# Altium schematic sheet Buck_Schematic.schdoc
size 356 x 151 mm; SheetNumber: 1; SheetTotal: 1
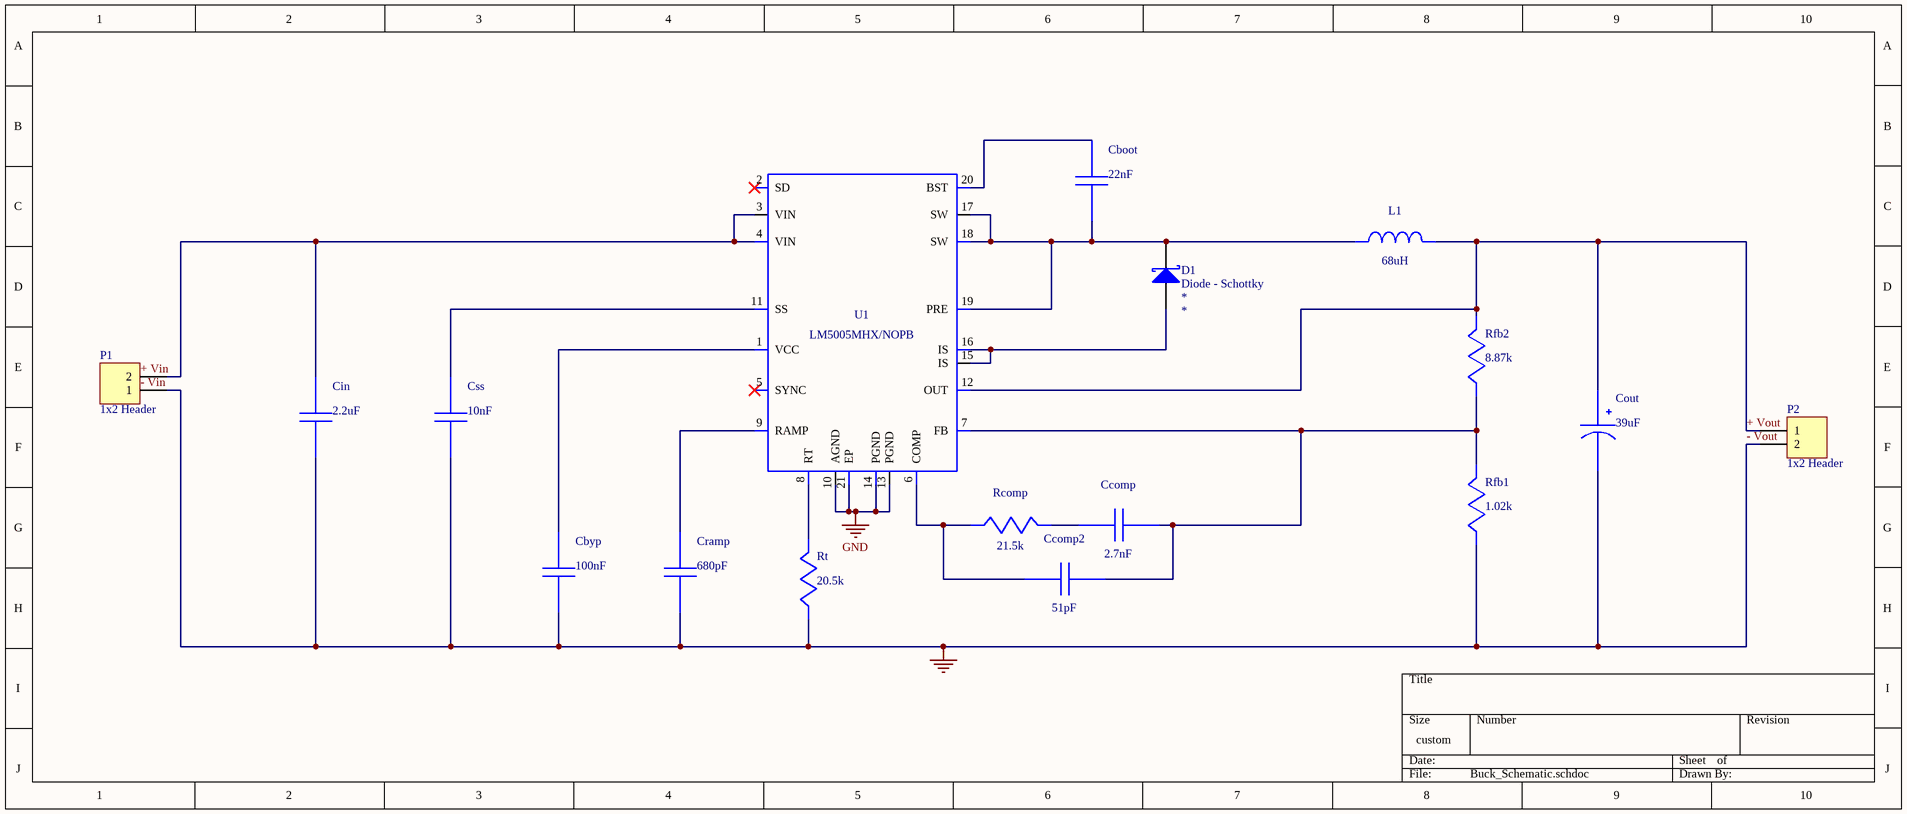
[diagram p0: Buck_Schematic.schdoc]

## Parts
Cboot  value 22nF  [0805 - Capacitor]  (hidden comment: C0805C223K5RACTU)
Cbyp  value 100nF  [0805 - Capacitor]  (hidden comment: C0805C104M5RACTU)
Ccomp  value 2.7nF  (hidden comment: GRM033R71C272KA88D)
Ccomp2  value 51pF  [0805 - Capacitor]  (hidden comment: CL21C510JBANNNC)
Cin  value 2.2uF  [1210 - Capacitor]  (hidden comment: C3225X7R2A225K230AB)
Cout  value 39uF  (hidden comment: 16SVPC39MV)
Cramp  value 680pF  [0603 - Capacitor]  (hidden comment: C0603C681K5RACTU)
Css  value 10nF  [0805 - Capacitor]  (hidden comment: CC0805KRX7R9BB103)
D1  Diode - Schottky
L1  value 68uH  [MSS1210 - INDUCTOR]  (hidden comment: MSS1210-683MEB)
P1  1x2 Header  [HDR1X2]
P2  1x2 Header  [HDR1X2]
Rcomp  value 21.5k  [0603 - Resistor]  (hidden comment: CRCW060321K5FKEA)
Rfb1  value 1.02k  [0805 - Resistor]  (hidden comment: ERJ-6ENF1021V)
Rfb2  value 8.87k  [0805 - Resistor]  (hidden comment: ERJ-6ENF8871V)
Rt  value 20.5k  [0603 - Resistor]  (hidden comment: CRCW060320K5FKEA)
U1  LM5005MHX/NOPB  [LM5005]

## Nets
- Vout: Cbyp.2 Cin.2 Cout.2(-) Cramp.2 Css.2 P1.1 P2.2 Rfb1.2 Rt.2  [also labelled 0]
GND: U1.10(AGND) U1.13(PGND) U1.14(PGND) U1.21(EP)
+ Vout: Cout.1(+) L1.2 P2.1 Rfb2.1 U1.12(OUT)
NetCboot_1: Cboot.1 U1.20(BST)
NetCboot_2: Cboot.2 D1.1(K) L1.1 U1.17(SW) U1.18(SW) U1.19(PRE)
NetCbyp_1: Cbyp.1 U1.1(VCC)
NetCcomp2_2: Ccomp2.2 Rcomp.2 U1.6(COMP)
NetCcomp_1: Ccomp.1 Ccomp2.1 Rfb1.1 Rfb2.2 U1.7(FB)
NetCcomp_2: Ccomp.2 Rcomp.1
NetCin_1: Cin.1 P1.2 U1.3(VIN) U1.4(VIN)
NetCramp_1: Cramp.1 U1.9(RAMP)
NetCss_1: Css.1 U1.11(SS)
NetD1_3: D1.3(A) U1.15(IS) U1.16(IS)
NetRt_1: Rt.1 U1.8(RT)

Not connected (* = marked no-connect by the designer): U1 2(SD)* 5(SYNC)*

## Notes on the sheet
- Labels drawn without touching a wire or pin: + Vin, - Vin

## Library data of the parts
Cboot = C0805C223K5RACTU: Manufacturer Name: Kemet; PackageReference: C0805C223K5RACTU; Manufacturer Part Number: C0805C223K5RACTU
Cbyp = C0805C104M5RACTU: Manufacturer Name: Kemet; PackageReference: C0805C104M5RACTU; Manufacturer Part Number: C0805C104M5RACTU
Ccomp = GRM033R71C272KA88D: GRM033R71C272KA8; Manufacturer Name: MuRata; PackageReference: GRM033R71C272KA88D; Manufacturer Part Number: GRM033R71C272KA88D
Ccomp2 = CL21C510JBANNNC: Manufacturer Name: Samsung Electro-Mechanics; PackageReference: CL21C510JBANNNC; Manufacturer Part Number: CL21C510JBANNNC
Cin = C3225X7R2A225K230AB: C3225X7R2A225K23; Manufacturer Name: TDK; PackageReference: C3225X7R2A225K230AB; Manufacturer Part Number: C3225X7R2A225K230AB
Cout = 16SVPC39MV: Manufacturer Name: Panasonic; PackageReference: 16SVPC39MV; Manufacturer Part Number: 16SVPC39MV
Cramp = C0603C681K5RACTU: Manufacturer Name: Kemet; PackageReference: C0603C681K5RACTU; Manufacturer Part Number: C0603C681K5RACTU
Css = CC0805KRX7R9BB103: CC0805KRX7R9BB10; Manufacturer Name: Yageo; PackageReference: CC0805KRX7R9BB103; Manufacturer Part Number: CC0805KRX7R9BB103
D1 = Diode - Schottky: Schottky Rectifier; Rating: *; Supplier Part Number: *; Supplier: *; Manufacturer: *; ComponentLink1Description: Manufacturer Link; ComponentLink1URL: http://www.irf.com/; ComponentLink2Description: Datasheet; ComponentLink2URL: http://www.irf.com/product-info/datasheets/data/10tq.pdf; Value: *; Manufacturer Part Number: *
L1 = MSS1210-683MEB: Unknown; Manufacturer Name: Coilcraft; PackageReference: MSS1210-683MEB; Manufacturer Part Number: MSS1210-683MEB
P1 P2 = 1x2 Header: 1x2 Pin Header
Rcomp = CRCW060321K5FKEA: Manufacturer Name: Vishay-Dale; PackageReference: CRCW060321K5FKEA; Manufacturer Part Number: CRCW060321K5FKEA
Rfb1 = ERJ-6ENF1021V: Manufacturer Name: Panasonic; PackageReference: ERJ-6ENF1021V; Manufacturer Part Number: ERJ-6ENF1021V
Rfb2 = ERJ-6ENF8871V: Manufacturer Name: Panasonic; PackageReference: ERJ-6ENF8871V; Manufacturer Part Number: ERJ-6ENF8871V
Rt = CRCW060320K5FKEA: Manufacturer Name: Vishay-Dale; PackageReference: CRCW060320K5FKEA; Manufacturer Part Number: CRCW060320K5FKEA
U1 = LM5005MHX/NOPB: Manufacturer Name: Texas Instruments; PackageReference: LM5005MHX/NOPB; Manufacturer Part Number: LM5005MHX/NOPB; Value: N/A